# Altium project LASER_DRIVER_LN_HP.PrjPcb (part 2 of 4)

## Sheet DAC.SchDoc: AI ARTIQ Driver
size 420 x 297 mm; Author: G.Kasprowicz; CompanyName: CTI; Organization: CTI; Address1: CTI; Address2: Nowowiejska 15/19 00-665 Warsaw; Address3: gkasprow@gmail.com; DocumentNumber: 3; Revision: 1.0; SheetNumber: 3; SheetTotal: 11; ModifiedBy: -; CheckedDate: -; Title2: DAC; DivGrp: CTI; ModifiedDate: -; ProjectName: Sensor Box
Used 2 times, as channels U_DAC_LN, U_DAC_HP. Parts and nets are listed once, with the designators drawn on the sheet.
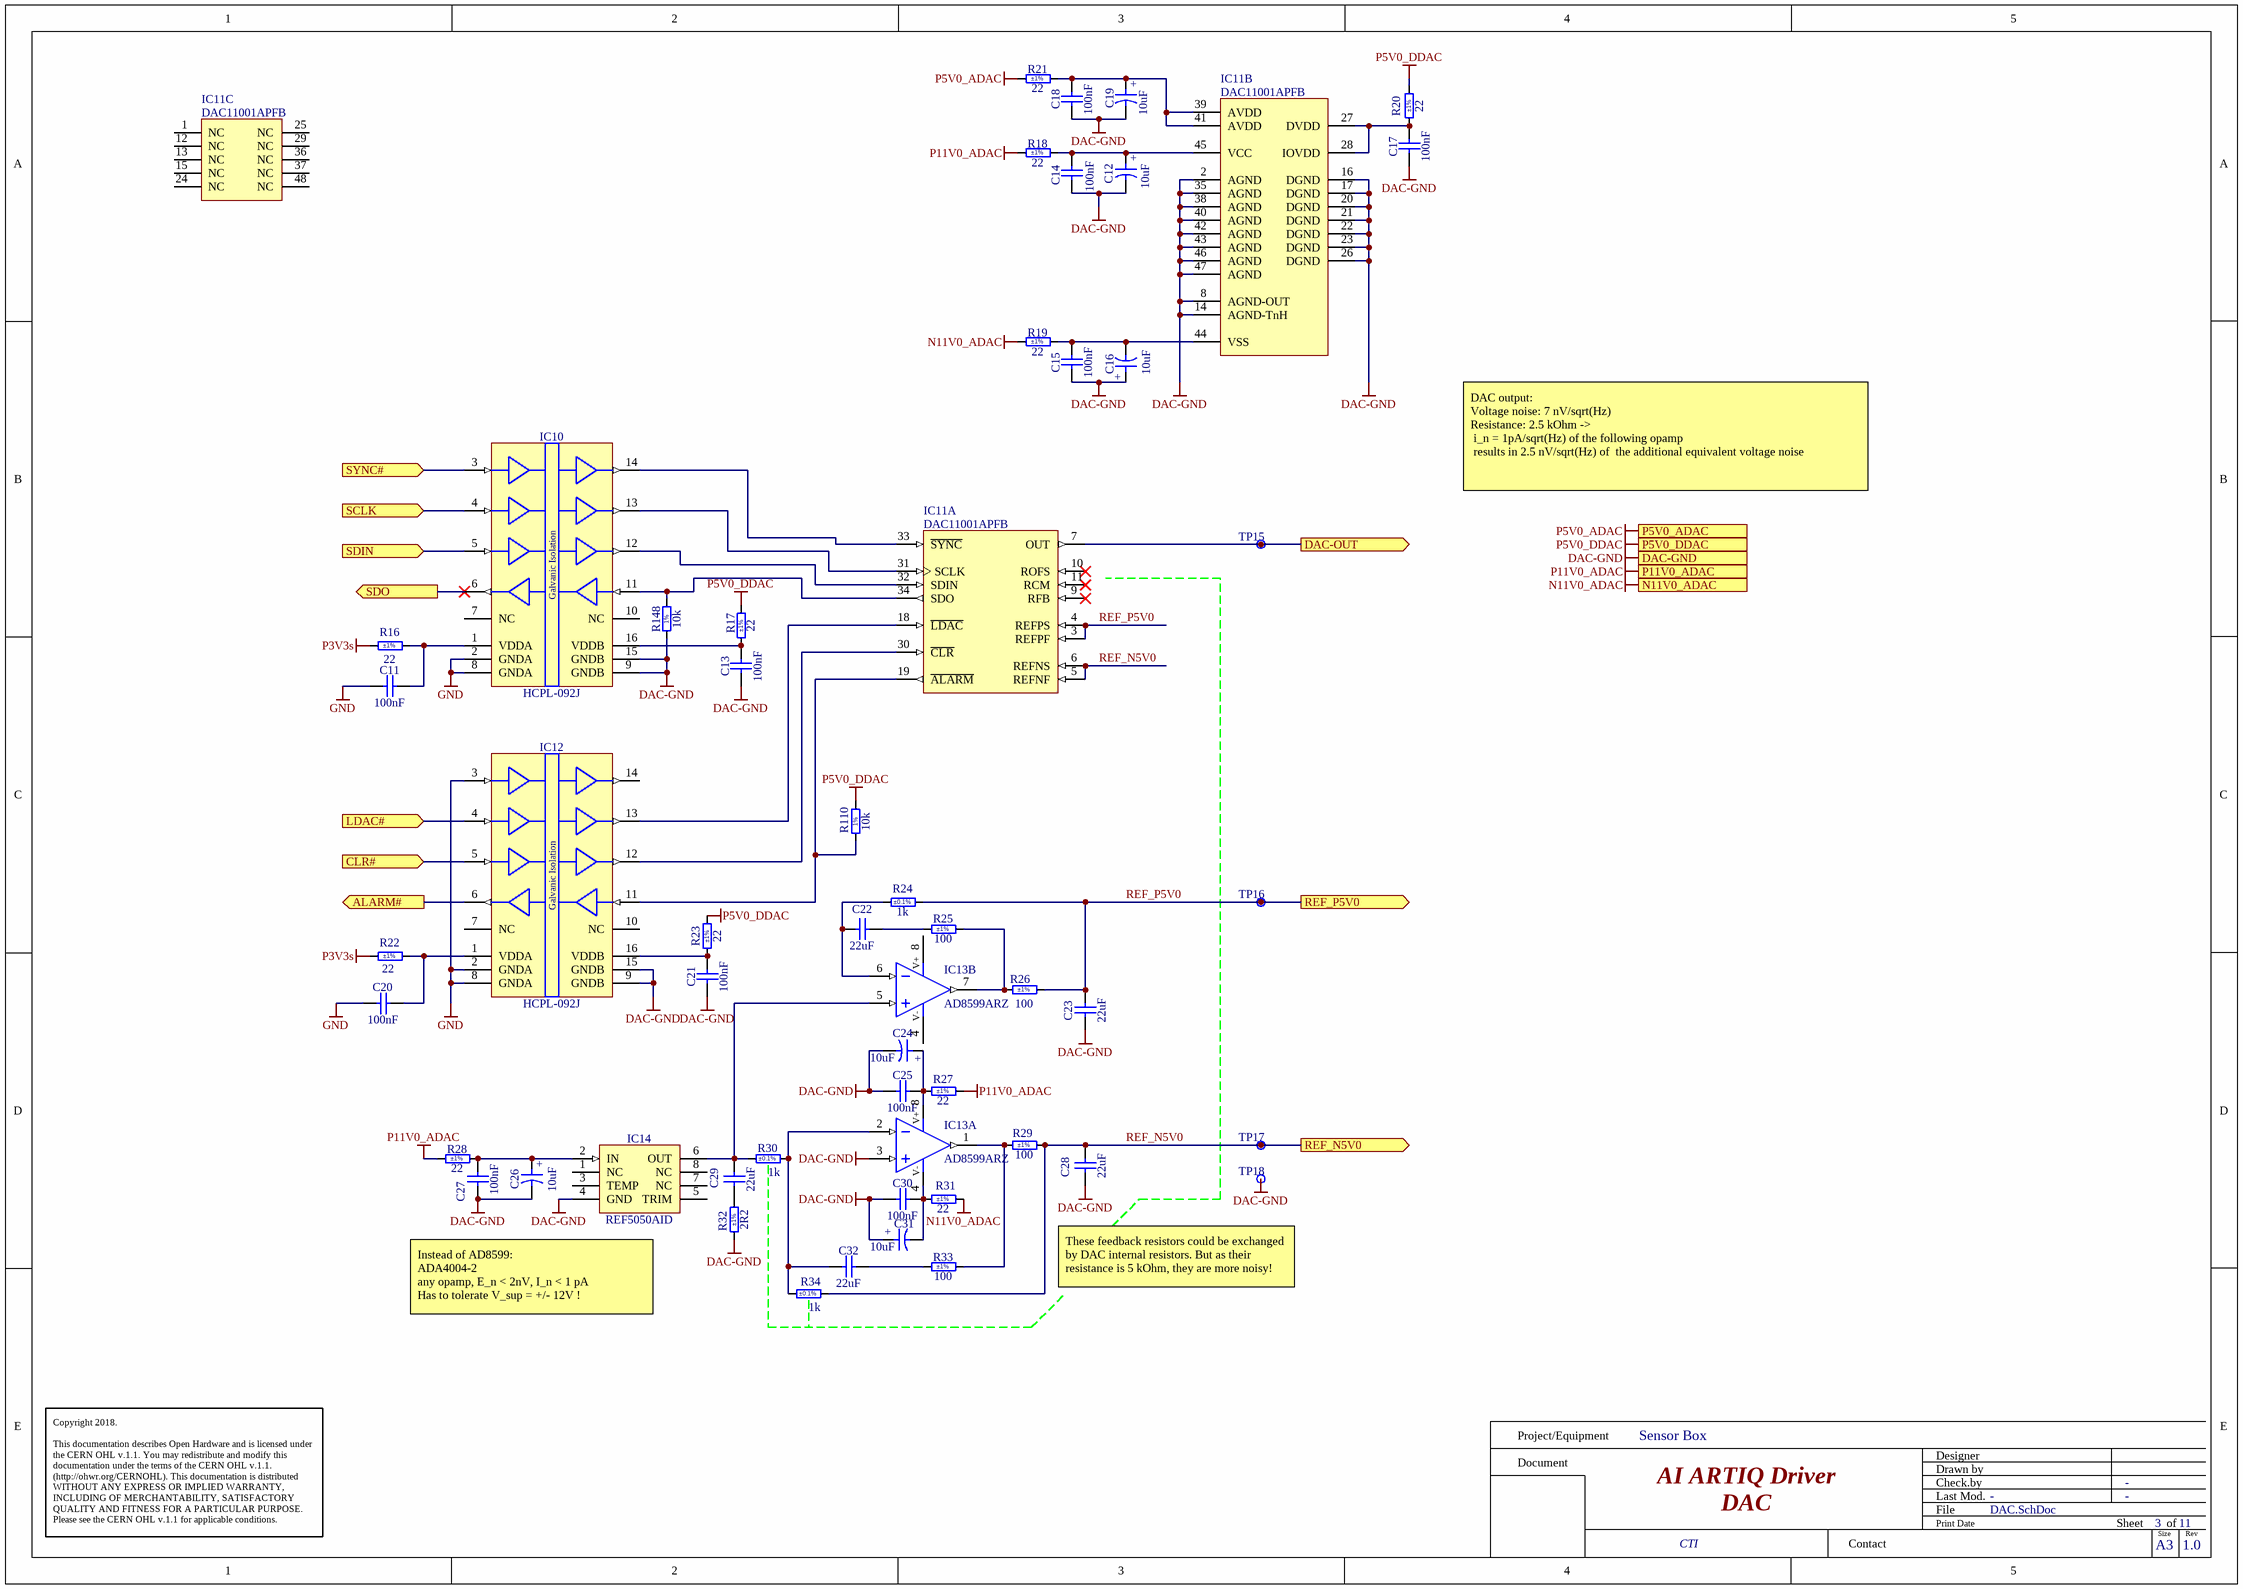
[diagram p2: DAC.SchDoc]

### Parts
C11  100nF  [CAPC1608X87N]
C12  10uF  [CAPMP3528X210N]
C13  100nF  [CAPC1608X87N]
C14  100nF  [CAPC1005X55N]
C15  100nF  [CAPC1005X55N]
C16  10uF  [CAPMP3528X210N]
C17  100nF  [CAPC1005X55N]
C18  100nF  [CAPC1005X55N]
C19  10uF  [CAPMP3528X210N]
C20  100nF  [CAPC1608X87N]
C21  100nF  [CAPC1608X87N]
C22  22uF  [CAPC2012X135N]
C23  22uF  [CAPC2012X135N]
C24  10uF  [CAPMP3528X210N]
C25  100nF  [CAPC1608X87N]
C26  10uF  [CAPMP3528X210N]
C27  100nF  [CAPC1608X87N]
C28  22uF  [CAPC2012X135N]
C29  22uF  [CAPC2012X135N]
C30  100nF  [CAPC1608X87N]
C31  10uF  [CAPMP3528X210N]
C32  22uF  [CAPC2012X135N]
IC10  HCPL-092J  [HCPL-092J]
IC11  DAC11001APFB  [QFP50P900X900X120-48N]  (parts A,B,C of 3)
IC12  HCPL-092J  [HCPL-092J]
IC13  AD8599ARZ  [SOIC127P600X175-8N]  (parts A,B of 2)
IC14  REF5050AID  [SOIC127P600X175-8N]
R16  22  Tolerance: ±1%  [RESC1608X55N]
R17  22  Tolerance: ±1%  [RESC1608X55N]
R18  22  Tolerance: ±1%  [RESC1608X55N]
R19  22  Tolerance: ±1%  [RESC1608X55N]
R20  22  Tolerance: ±1%  [RESC1608X55N]
R21  22  Tolerance: ±1%  [RESC1608X55N]
R22  22  Tolerance: ±1%  [RESC1608X55N]
R23  22  Tolerance: ±1%  [RESC1608X55N]
R24  1k  Tolerance: ±0.1%  [RESC1608X64N]
R25  100  Tolerance: ±1%  [RESC1608X55N]
R26  100  Tolerance: ±1%  [RESC1608X55N]
R27  22  Tolerance: ±1%  [RESC1608X55N]
R28  22  Tolerance: ±1%  [RESC1608X55N]
R29  100  Tolerance: ±1%  [RESC1608X55N]
R30  1k  Tolerance: ±0.1%  [RESC1608X64N]
R31  22  Tolerance: ±1%  [RESC1608X55N]
R32  2R2  Tolerance: ±1%  [RESC1608X55N]
R33  100  Tolerance: ±1%  [RESC1608X55N]
R34  1k  Tolerance: ±0.1%  [RESC1608X64N]
R110  10k  [RESC1608X55N]
R148  10k  [RESC1608X55N]
TP15  Test Point  [TPS127]  (value not drawn)  (no BOM)
TP16  Test Point  [TPS127]  (value not drawn)  (no BOM)
TP17  Test Point  [TPS127]  (value not drawn)  (no BOM)
TP18  Test Point  [TPS127]  (value not drawn)  (no BOM)

### Ports
ALARM# (out), CLR# (in), DAC-GND, DAC-OUT (out), LDAC# (in), N11V0_ADAC, P5V0_ADAC, P5V0_DDAC, P11V0_ADAC, REF_N5V0 (out), REF_P5V0 (out), SCLK (in), SDIN (in), SDO (out), SYNC# (in)

### Nets
DAC-GND: C12.2 C13.1 C14.2 C15.1 C16.1 C17.1 C18.1 C19.2 C21.1 C23.1 C24.2 C25.1 C26.2 C27.1 C28.1 C30.1 C31.1 IC10.9(GNDB) IC10.15(GNDB) IC11.2(AGND) IC11.8(AGND-OUT) IC11.14(AGND-TnH) IC11.16(DGND) IC11.17(DGND) IC11.20(DGND) IC11.21(DGND) IC11.22(DGND) IC11.23(DGND) IC11.26(DGND) IC11.35(AGND) IC11.38(AGND) IC11.40(AGND) IC11.42(AGND) IC11.43(AGND) IC11.46(AGND) IC11.47(AGND) IC12.9(GNDB) IC12.15(GNDB) IC13.3(IN+) IC14.4(GND) R32.1 R148.1 TP18.1 ; port DAC-GND
GND: C11.1 C20.1 IC10.2(GNDA) IC10.8(GNDA) IC12.2(GNDA) IC12.3(IN1) IC12.8(GNDA)
N11V0_ADAC: R19.1 R31.2 ; port N11V0_ADAC
P3V3s: R16.2 R22.2
P5V0_ADAC: R21.1 ; port P5V0_ADAC
P5V0_DDAC: R17.2 R20.2 R23.2 R110.2 ; port P5V0_DDAC
P11V0_ADAC: R18.1 R27.2 R28.1 ; port P11V0_ADAC
ALARM#: IC12.6(IN4) ; port ALARM#
CLR#: IC12.5(IN3) ; port CLR#
DAC-OUT: IC11.7(OUT) TP15.1 ; port DAC-OUT
LDAC#: IC12.4(IN2) ; port LDAC#
REF_N5V0: C28.2 IC11.5(REFNF) IC11.6(REFNS) R29.2 R34.2 TP17.1 ; port REF_N5V0
REF_P5V0: C23.2 IC11.3(REFPF) IC11.4(REFPS) R24.2 R26.2 TP16.1 ; port REF_P5V0
SCLK: IC10.4(IN2) ; port SCLK
SDIN: IC10.5(IN3) ; port SDIN
SDO: IC10.6(IN4) ; port SDO
SYNC#: IC10.3(IN1) ; port SYNC#
NetC11_2: C11.2 IC10.1(VDDA) R16.1
NetC12_1: C12.1 C14.1 IC11.45(VCC) R18.2
NetC13_2: C13.2 IC10.16(VDDB) R17.1
NetC15_2: C15.2 C16.2 IC11.44(VSS) R19.2
NetC17_2: C17.2 IC11.27(DVDD) IC11.28(IOVDD) R20.1
NetC18_2: C18.2 C19.1 IC11.39(AVDD) IC11.41(AVDD) R21.2
NetC20_2: C20.2 IC12.1(VDDA) R22.1
NetC21_2: C21.2 IC12.16(VDDB) R23.1
NetC22_1: C22.1 IC13.6(IN-) R24.1
NetC22_2: C22.2 R25.1
NetC24_1: C24.1 C25.2 IC13.8(V+) R27.1
NetC26_1: C26.1 C27.2 IC14.2(IN) R28.2
NetC29_1: C29.1 R32.2
NetC29_2: C29.2 IC13.5(IN+) IC14.6(OUT) R30.1
NetC30_2: C30.2 C31.2 IC13.4(V-) R31.1
NetC32_1: C32.1 IC13.2(IN-) R30.2 R34.1
NetC32_2: C32.2 R33.1
NetIC10_11: IC10.11(OUT4) IC11.34(SDO) R148.2
NetIC10_12: IC10.12(OUT3) IC11.32(SDIN)
NetIC10_13: IC10.13(OUT2) IC11.31(SCLK)
NetIC10_14: IC10.14(OUT1) IC11.33(~{SYNC})
NetIC11_18: IC11.18(~{LDAC}) IC12.13(OUT2)
NetIC11_19: IC11.19(~{ALARM}) IC12.11(OUT4) R110.1
NetIC11_30: IC11.30(~{CLR}) IC12.12(OUT3)
NetIC13_1: IC13.1(OUT) R29.1 R33.2
NetIC13_7: IC13.7(OUT) R25.2 R26.1

Not connected (* = marked no-connect by the designer): IC10 7(NC) 10(NC); IC11 1(NC) 9(RFB)* 10(ROFS)* 11(RCM)* 12(NC) 13(NC) 15(NC) 24(NC) 25(NC) 29(NC) 36(NC) 37(NC) 48(NC); IC12 7(NC) 10(NC) 14(OUT1); IC14 1(NC) 3(TEMP) 5(TRIM) 7(NC) 8(NC)

### Channels
U_DAC_LN: designators end in A; ports ALARM#=NetIC12A_6 CLR#=NetIC12A_5 DAC-GND=DAC-GND DAC-OUT=NetIC11A_7 LDAC#=NetIC12A_4 N11V0_ADAC=N11V0_ADAC P5V0_ADAC=P5V0_ADAC P5V0_DDAC=P5V0_DDAC P11V0_ADAC=P11V0_ADAC REF_N5V0=REF_N5V0 REF_P5V0=REF_P5V0 SCLK=SPI1_SCK SDIN=SPI1_MOSI SDO=SPI1_MISO SYNC#=SPI1_NSS
U_DAC_HP: designators end in B; ports ALARM#=NetIC12B_6 CLR#=NetIC12A_5 DAC-GND=DAC-GND DAC-OUT=NetIC7_3 LDAC#=NetIC12A_4 N11V0_ADAC=N11V0_ADAC P5V0_ADAC=P5V0_ADAC P5V0_DDAC=P5V0_DDAC P11V0_ADAC=P11V0_ADAC REF_N5V0=REF_N5V0 REF_P5V0=REF_P5V0 SCLK=SPI1_SCK SDIN=SPI1_MOSI SDO=SPI1_MISO SYNC#=PA0/UART4_TX

### Notes on the sheet
- DAC output:
  Voltage noise: 7 nV/sqrt(Hz)
  Resistance: 2.5 kOhm ->
  i_n = 1pA/sqrt(Hz) of the following opamp
  results in 2.5 nV/sqrt(Hz) of  the additional equivalent voltage noise
- Instead of AD8599:
  ADA4004-2
  any opamp, E_n < 2nV, I_n < 1 pA
  Has to tolerate V_sup = +/- 12V !
- These feedback resistors could be exchanged by DAC internal resistors. But as their resistance is 5 kOhm, they are more noisy!
- Project/Equipment
- Document
- Designer
- Drawn by
- Check.by
- Copyright 2018.
  This documentation describes Open Hardware and is licensed under the CERN OHL v.1.1. You may redistribute and modify this documentation under the terms of the CERN OHL v.1.1. (http://ohwr.org/CERNOHL). This documentation is distributed WITHOUT ANY EXPRESS OR IMPLIED WARRANTY, INCLUDING OF MERCHANTABILITY, SATISFACTORY QUALITY AND FITNESS FOR A PARTICULAR PURPOSE. Please see the CERN OHL v.1.1 for applicable conditions.
- Contact
- File
- Last Mod.
- Print Date
- Sheet
- Size
- A3
- of
- Rev
- (in symbol CTE3528-21_10UF_20V_10%_AVX_TPSB106K020T0500) +
- (in symbol HCPL-092J) Galvanic Isolation
- (in symbol R0603_10K_1%_0.1W_100PPM) 1%

### Library data of the parts
C11 C13 C20 C21 C25 C27 C30 = CC0603_100NF_50V_10%_X7R: Non-polarised capacitor; Part Description: SMD Multilayer Chip Ceramic Capacitor; Manufacturer: GENERIC; Manufacturer1 Part Number: 223858615649; Voltage: 50V; TC: X7R; Tolerance: ±10%; Part Number: CC0603_100NF_50V_10%_X7R; Component Kind: Standard; Component Type: Standard; Pin Count: 2; Value: 100nF; Status: Preferred; Manufacturer Part Number: CC0603_100NF_50V_10%_X7R; Case: 0603; Mounted: Yes; Socket: No; SMD: Yes; Sense: No; Manufacturer1 Example: PHYCOMP; Manufacturer1 ComponentHeight: 0.87mm; HelpURL: \\cern.ch\dfs\Applications\Altium\Datasheets\CC0603_X7R_PHYCOMP.pdf; Author: CERN DEM JLC; CreateDate: 03.12.2007; LatestRevisionDate: 03.12.2007
C12 C16 C19 C24 C26 C31 = CTE3528-21_10UF_20V_10%_AVX_TPSB106K020T0500: Polarised capacitor; Part Description: Low ESR 0R5 Automotive Solid Tantalum Chip Capacitor; Manufacturer: AVX; Voltage: 20V; Tolerance: ±10%; Part Number: CTE3528-21_10UF_20V_10%_AVX_TPSB106K020T0500; Component Kind: Standard; Component Type: Standard; Pin Count: 2; Value: 10uF; Status: Not Recommended; Manufacturer Part Number: TPSB106K020T0500; Case: B; Mounted: Yes; Socket: No; SMD: Yes; Sense: No; ComponentHeight: 2.1mm; HelpURL: \\cern.ch\dfs\Applications\Altium\Datasheets\CTE-LESR_AVX_TPS-AUTO.pdf; Author: CERN DEM JLC; CreateDate: 10.05.2017; LatestRevisionDate: 10.05.2017
C14 C15 C17 C18 = CC0402_100NF_50V_10%_X7R: Non-polarised capacitor; Part Description: SMD Multilayer Chip Ceramic Capacitor; Manufacturer: GENERIC; Manufacturer1 Part Number: GRM155R71H104KE14D; Voltage: 50V; TC: X7R; Tolerance: ±10%; Part Number: CC0402_100NF_50V_10%_X7R; Component Kind: Standard; Component Type: Standard; Pin Count: 2; Value: 100nF; Status: None; Manufacturer Part Number: CC0402_100NF_50V_10%_X7R; Case: 0402; Mounted: Yes; Socket: No; SMD: Yes; Sense: No; Manufacturer1 Example: MURATA; Manufacturer1 ComponentHeight: 0.55mm; HelpURL: \\cern.ch\dfs\Applications\Altium\Datasheets\CC0402_MURATA_GRM155R71H104KE14D.pdf; Author: CERN DEM MR; CreateDate: 30.06.2017; LatestRevisionDate: 30.06.2017
C22 C23 C28 C29 C32 = CC0805_22UF_16V_10%_X5R: Non-polarised capacitor; Part Description: SMD Multilayer Chip Ceramic Capacitor; Manufacturer: GENERIC; Manufacturer1 Part Number: C2012X5R1C226KT; Voltage: 16V; TC: X5R; Tolerance: ±10%; Part Number: CC0805_22UF_16V_10%_X5R; Component Kind: Standard; Component Type: Standard; Pin Count: 2; Value: 22uF; Status: Preferred; Manufacturer Part Number: CC0805_22UF_16V_10%_X5R; Case: 0805; Mounted: Yes; Socket: No; SMD: Yes; Sense: No; Manufacturer1 Example: TDK; Manufacturer1 ComponentHeight: 1.35mm; HelpURL: \\cern.ch\dfs\Applications\Altium\Datasheets\CC0805_X5R_TDK_C.pdf; Author: CERN DEM JLC; CreateDate: 25.10.2012; LatestRevisionDate: 25.10.2012
IC10 IC12 = HCPL-092J: High Speed Digital Isolators Quad, 1/3, Bidirectional; Part Description: 1/3 Channel, Bidirectional, High Speed Digital Isolators Quad; Manufacturer: BROADCOM; PressFit: No; Bonding: No; Part Number: HCPL-092J; Component Kind: Standard; Component Type: Standard; Device: HCPL-092J; Footprint: BROADCOM_HCPL-09X; PackageDescription: SOIC, 1.27mm Pitch; 16 Pin, 9.9mm W X 4.90mm L X 1.8mm H body; Manufacturer Part Number: HCPL-092J; Pin Count: 16; Case: SOIC16; Mounted: Yes; Socket: No; SMD: Yes; Sense: No; ComponentHeight: 1.8mm; Author: CERN DEM HF; HelpURL: \\cern.ch\dfs\Applications\Altium\Datasheets\HCPL-092J.pdf; CreateDate: 23.03.2022; LatestRevisionDate: 23.03.2022
IC11 = DAC11001APFB: 20 Bit, Low-Noise, Ultra-Low Harmonic Distortion, FastSettling, High-Voltage Output, Digital-to-Analog Converter; Manufacturer: TEXAS INSTRUMENTS; PressFit: No; Bonding: No; Part Number: DAC11001APFB; Component Kind: Standard; Component Type: Standard; Device: DAC11001APFB; PackageDescription: QFP, 0.50mm Pitch, Square, 48 Pin, 7.00mm L X 7.00mm W X 1.20mm H body, IPC Medium Density; Part Description: 20 Bit, Low-Noise, Ultra-Low Harmonic Distortion, FastSettling, High-Voltage Output, Digital-to-Analog Converter; Manufacturer Part Number: DAC11001APFB; Pin Count: 48; Case: QFP48; Mounted: Yes; Socket: No; SMD: Yes; Sense: No; ComponentHeight: 1.2mm; Author: CERN DEM HF; HelpURL: \\cern.ch\dfs\Applications\Altium\Datasheets\DAC11001APFB.pdf; CreateDate: 17.05.2022; LatestRevisionDate: 17.05.2022
IC13 = AD8599ARZ: Dual Operational Amplifier; Part Description: Dual, Ultralow Distorsion, Ultralow Noise Operational Amplifier; Manufacturer: ANALOG DEVICES; PressFit: No; Bonding: No; Part Number: AD8599ARZ; Component Kind: Standard; Component Type: Standard; Device: AD8599ARZ; PackageDescription: SOIC, 1.27mm Pitch; 8 Pin, 4.00mm W X 5.00mm L X 1.75mm H body, IPC Medium Density; Manufacturer Part Number: AD8599AR; Pin Count: 8; Case: SOIC8; Mounted: Yes; Socket: No; SMD: Yes; Sense: No; ComponentHeight: 1.75mm; Author: CERN DEM BC; HelpURL: \\cern.ch\dfs\Applications\Altium\Datasheets\AD8599ARZ.pdf; CreateDate: 01.12.2020; LatestRevisionDate: 29.03.2022
IC14 = REF5050AID: Low-Noise, Very Low Drift, Precision Voltage Reference; Part Description: 5V, Low-Noise, Very Low Drift, Precision Voltage Reference; Manufacturer: TEXAS INSTRUMENTS; PressFit: No; Bonding: No; Part Number: REF5050AID; Component Kind: Standard; Component Type: Standard; Device: REF5050AID; PackageDescription: SOIC 8, Pitch 1.27mm, Body 4x5mm, IPC Medium Density; Manufacturer Part Number: REF5050AID; Pin Count: 8; Case: SOIC8; Mounted: Yes; Socket: No; SMD: Yes; Sense: No; ComponentHeight: 1.75mm; HelpURL: \\cern.ch\dfs\Applications\Altium\Datasheets\REF5045AID.pdf; Author: CERN DEM HF; CreateDate: 18.05.2022; LatestRevisionDate: 18.05.2022
R16-R23 R27 R28 R31 = R0603_22R_1%_0.1W_100PPM: Resistor - 1%; Part Description: General Purpose Thick Film Chip Resistor; Manufacturer: GENERIC; Manufacturer1 Part Number: NRC06F22R0TRF; Power: 0.1W; TC: ±100ppm/°C; PressFit: No; Part Number: R0603_22R_1%_0.1W_100PPM; Component Kind: Standard; Component Type: Standard; Pin Count: 2; Value: 22; Status: Preferred; Manufacturer Part Number: R0603_22R_1%_0.1W_100PPM; Case: 0603; Mounted: Yes; Sense: No; Socket: No; SMD: Yes; Manufacturer1 Example: NIC COMPONENT; Manufacturer1 ComponentHeight: 0.55mm; HelpURL: \\cern.ch\dfs\Applications\Altium\Datasheets\R0603_NIC_NRC.pdf; Author: CERN DEM JLC; CreateDate: 03.12.2007; LatestRevisionDate: 13.03.2008
R24 R30 R34 = R0603_1K_0.1%_0.1W_25PPM: Resistor - 0.1%; Part Description: Thin Film Chip Resistor; Manufacturer: GENERIC; Manufacturer1 Part Number: ERA3AEB102V; Power: 0.1W; TC: ±25ppm/°C; PressFit: No; Part Number: R0603_1K_0.1%_0.1W_25PPM; Component Kind: Standard; Component Type: Standard; Pin Count: 2; Value: 1k; Status: Not Recommended; Manufacturer Part Number: R0603_1K_0.1%_0.1W_25PPM; Case: 0603; Mounted: Yes; Sense: No; Socket: No; SMD: Yes; Manufacturer1 Example: PANASONIC; Manufacturer1 ComponentHeight: 0.55mm; HelpURL: \\cern.ch\dfs\Applications\Altium\Datasheets\R0603_PANASONIC_ERA.pdf; Author: CERN DEM JLC; CreateDate: 11.01.2017; LatestRevisionDate: 11.01.2017
R25 R26 R29 R33 = R0603_100R_1%_0.1W_100PPM: Resistor - 1%; Part Description: General Purpose Thick Film Chip Resistor; Manufacturer: GENERIC; Manufacturer1 Part Number: NRC06F4700TRF; Power: 0.1W; TC: ±100ppm/°C; PressFit: No; Part Number: R0603_100R_1%_0.1W_100PPM; Component Kind: Standard; Component Type: Standard; Pin Count: 2; Value: 100; Status: Preferred; Manufacturer Part Number: R0603_100R_1%_0.1W_100PPM; Case: 0603; Mounted: Yes; Sense: No; Socket: No; SMD: Yes; Manufacturer1 Example: NIC COMPONENT; Manufacturer1 ComponentHeight: 0.55mm; HelpURL: \\cern.ch\dfs\Applications\Altium\Datasheets\R0603_NIC_NRC.pdf; Author: CERN DEM JLC; CreateDate: 03.12.2007; LatestRevisionDate: 13.03.2008
R32 = R0603_2R2_1%_0.1W_200PPM: Resistor - 1%; Part Description: General Purpose Thick Film Chip Resistor; Manufacturer: GENERIC; Manufacturer1 Part Number: 232270462208L or RC0603FR-072R2L; Power: 0.1W; TC: ±200ppm/°C; PressFit: No; Part Number: R0603_2R2_1%_0.1W_200PPM; Component Kind: Standard; Component Type: Standard; Pin Count: 2; Value: 2R2; Status: Preferred; Manufacturer Part Number: R0603_2R2_1%_0.1W_200PPM; Case: 0603; Mounted: Yes; Sense: No; Socket: No; SMD: Yes; Manufacturer1 Example: YAGEO PHYCOMP; Manufacturer1 ComponentHeight: 0.65mm; HelpURL: \\cern.ch\dfs\Applications\Altium\Datasheets\R0603_Tyco_RN73.pdf; Author: CERN DEM JLC; CreateDate: 03.12.2007; LatestRevisionDate: 17.10.2012
R110 R148 = R0603_10K_1%_0.1W_100PPM: Resistor - 1%; Part Description: General Purpose Thick Film Chip Resistor; Manufacturer: GENERIC; Manufacturer1 Part Number: NRC06F1002TRF; Power: 0.1W; TC: ±100ppm/°C; PressFit: No; Part Number: R0603_10K_1%_0.1W_100PPM; Component Kind: Standard; Component Type: Standard; Pin Count: 2; Value: 10k; Status: Preferred; Tolerance: ±1%; Manufacturer Part Number: R0603_10K_1%_0.1W_100PPM; Case: 0603; Mounted: Yes; Sense: No; Socket: No; SMD: Yes; Manufacturer1 Example: NIC COMPONENT; Manufacturer1 ComponentHeight: 0.55mm; HelpURL: \\cern.ch\dfs\Applications\Altium\Datasheets\R0603_NIC_NRC.pdf; Author: CERN DEM JLC; CreateDate: 03.12.2007; LatestRevisionDate: 13.03.2008
TP15-TP18 = SMD_PAD_1.27X1.27MM: Part Description: 1.27mm x 1.27mm PCB Copper Area (SMD Test Point); Mounted: No; Part Number: SMD_PAD_1.27X1.27MM; Component Type: Standard (No BOM); Pin Count: 1; Family: Test Point; Socket: No; SMD: No; Sense: No; Status: None; ComponentHeight: 0mm; HelpURL: Undefined; Author: CERN DEM JLC; CreateDate: 12.01.2008; LatestRevisionDate: 12.01.2008; PackageDescription: 1.27mm x 1.27mm PCB Copper Area (SMD Test Point)

## Sheet connectors.SchDoc: AI ARTIQ Driver
size 420 x 297 mm; Author: G.Kasprowicz; CompanyName: CTI; Organization: CTI; Address1: CTI; Address2: Nowowiejska 15/19 00-665 Warsaw; Address3: gkasprow@gmail.com; DocumentNumber: 4; Revision: 1.0; SheetNumber: 4; SheetTotal: 11; ModifiedBy: -; CheckedDate: -; Title2: connectors; DivGrp: CTI; ModifiedDate: -; ProjectName: Sensor Box
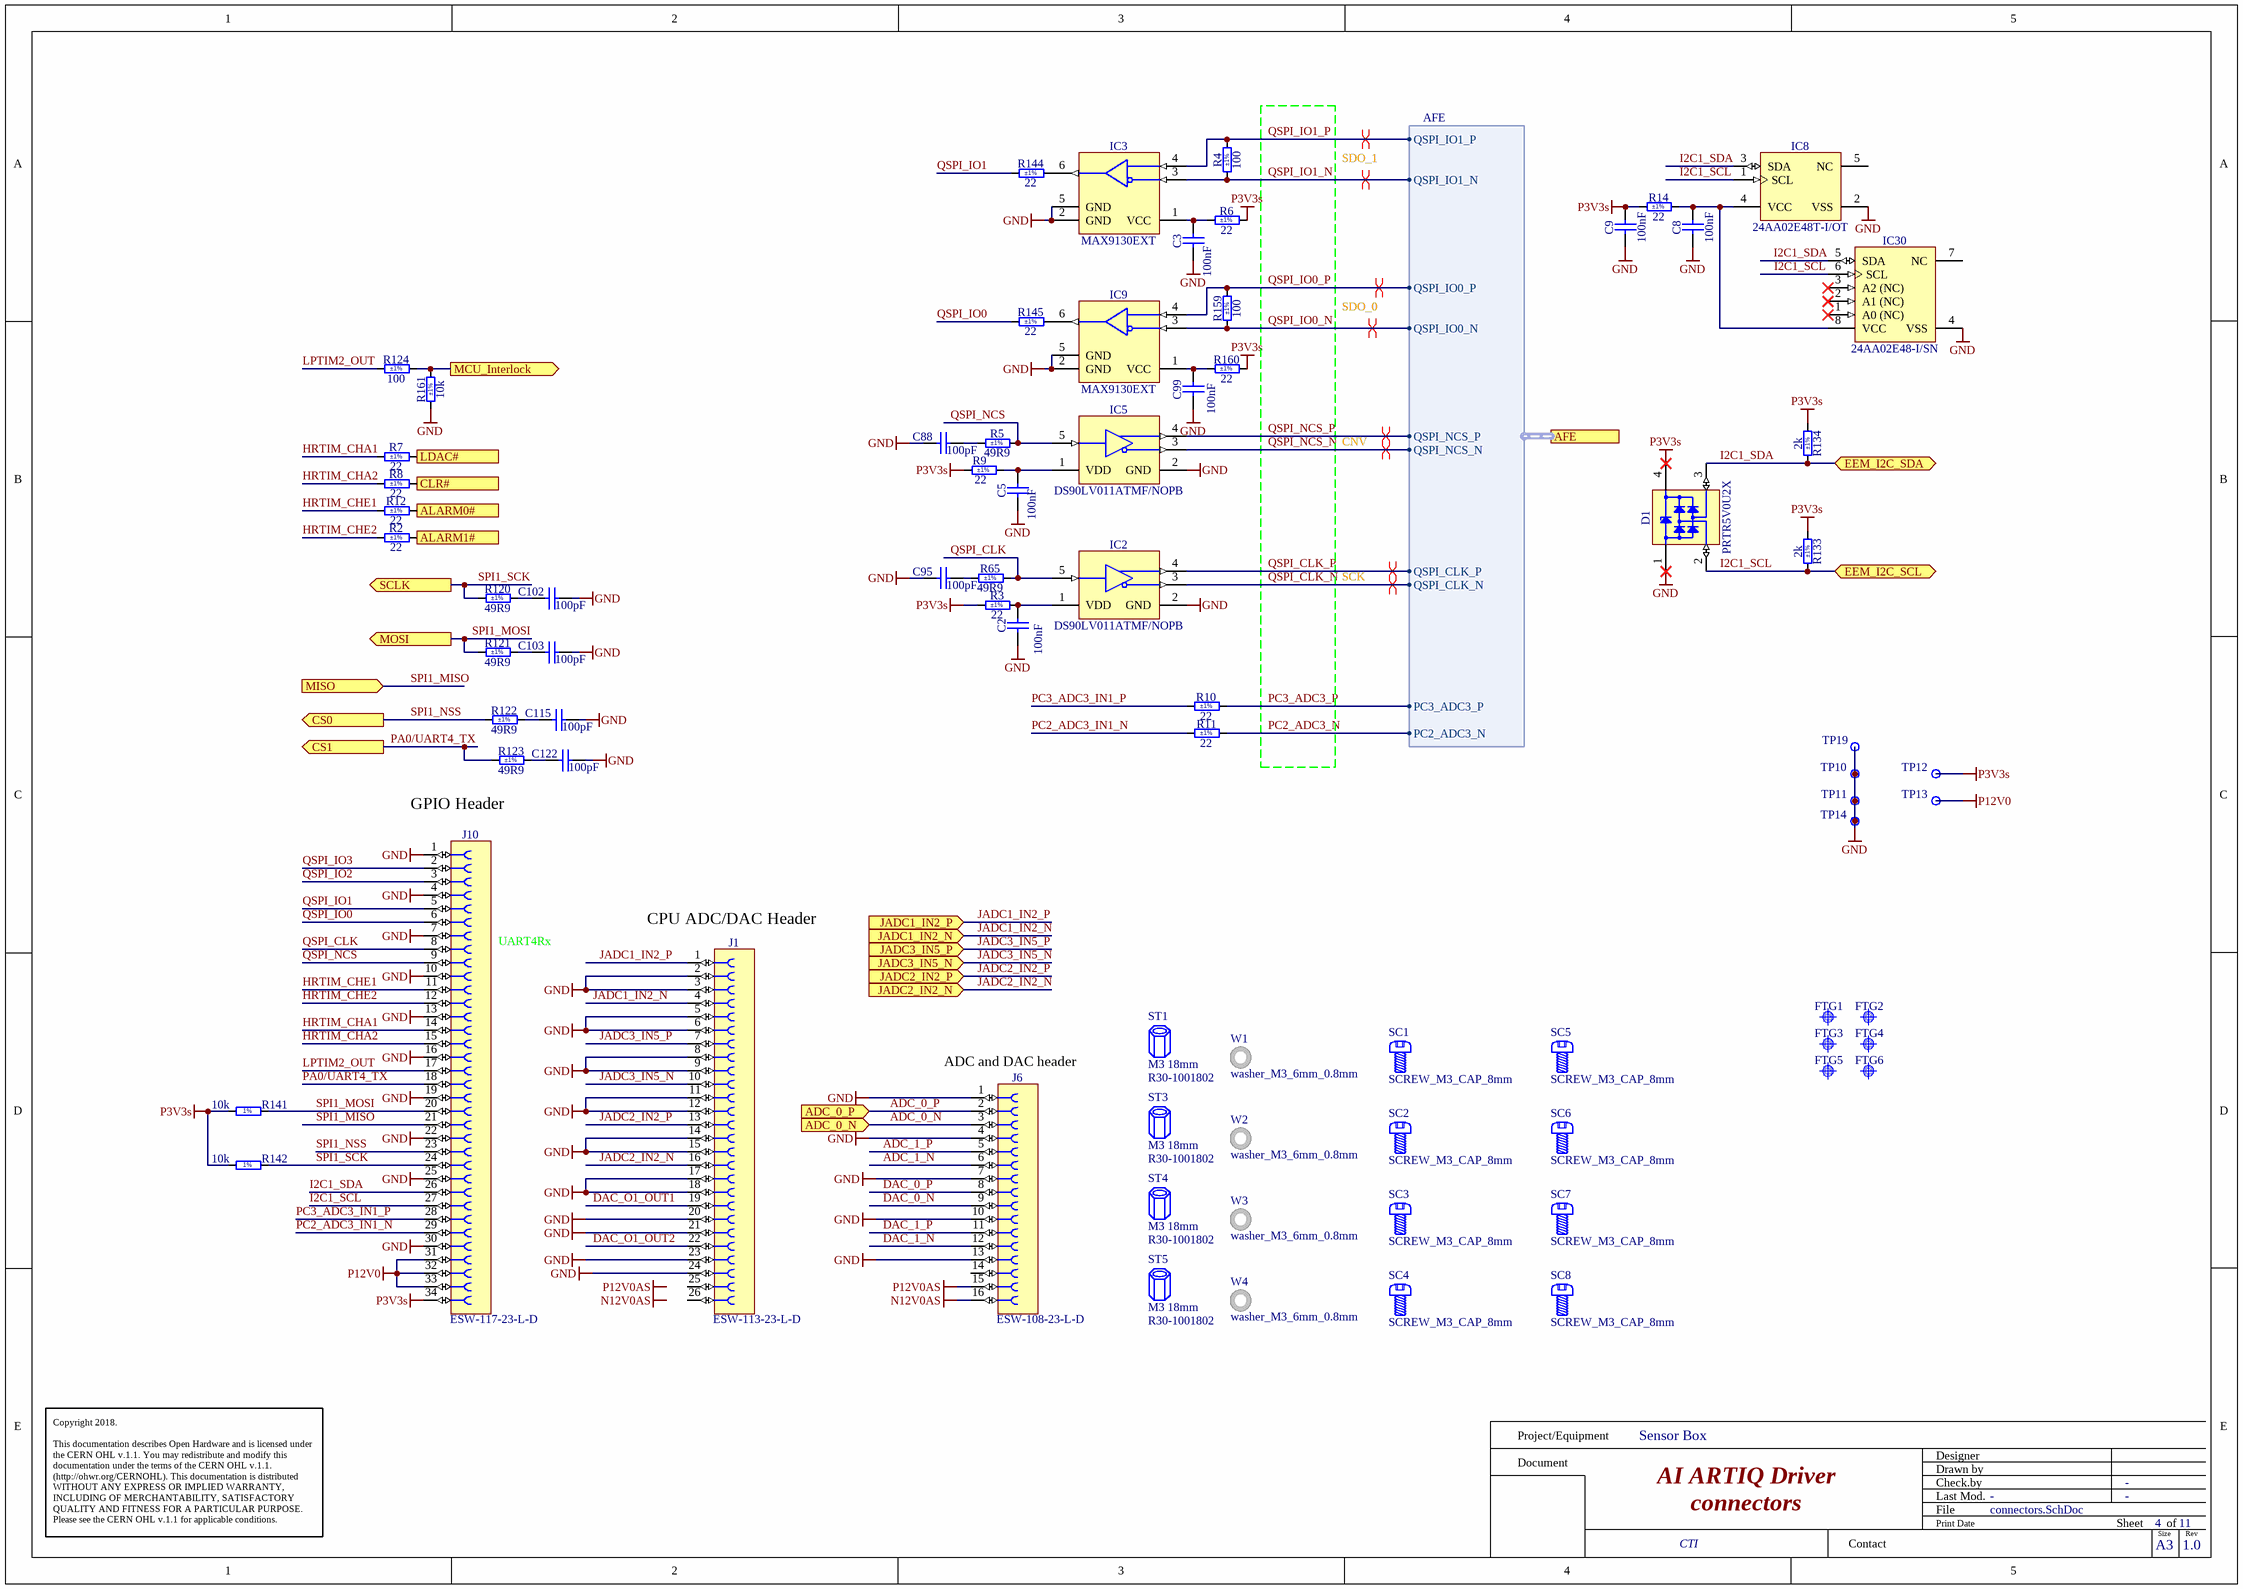
[diagram p3: connectors.SchDoc]

### Parts
C2  100nF  [CAPC2012X135N]
C3  100nF  [CAPC2012X135N]
C5  100nF  [CAPC2012X135N]
C8  100nF  [CAPC2012X135N]
C9  100nF  [CAPC2012X135N]
C88  100pF  [CAPC1005X55N]
C95  100pF  [CAPC1005X55N]
C99  100nF  [CAPC2012X135N]
C102  100pF  [CAPC1005X55N]
C103  100pF  [CAPC1005X55N]
C115  100pF  [CAPC1005X55N]
C122  100pF  [CAPC1005X55N]
D1  PRTR5V0U2X  [SOT190P230X110-4N]
FTG1  Use only in PCB  [FIDUCIAL_TOP_C100-200]  (value not drawn)  (no BOM)
FTG2  Use only in PCB  [FIDUCIAL_TOP_C100-200]  (value not drawn)  (no BOM)
FTG3  Use only in PCB  [FIDUCIAL_TOP_C100-200]  (value not drawn)  (no BOM)
FTG4  Use only in PCB  [FIDUCIAL_TOP_C100-200]  (value not drawn)  (no BOM)
FTG5  Use only in PCB  [FIDUCIAL_TOP_C100-200]  (value not drawn)  (no BOM)
FTG6  Use only in PCB  [FIDUCIAL_TOP_C100-200]  (value not drawn)  (no BOM)
IC2  DS90LV011ATMF/NOPB  [SOT95P284X122-5N]
IC3  MAX9130EXT  [SOT65P210X110-6N]
IC5  DS90LV011ATMF/NOPB  [SOT95P284X122-5N]
IC8  24AA02E48T-I/OT  [SOT95P280X145-5N]
IC9  MAX9130EXT  [SOT65P210X110-6N]
IC30  24AA02E48-I/SN  [SOIC127P600X175-8N]
J1  ESW-113-23-L-D  [ESW-113-23-L-D]
J6  ESW-108-23-L-D  [ESW-108-23-L-D]
J10  ESW-117-23-L-D  [ESW-117-23-L-D]
R2  22  Tolerance: ±1%  [RESC1608X55N]
R3  22  Tolerance: ±1%  [RESC1608X55N]
R4  100  Tolerance: ±1%  [RESC1608X55N]
R5  49R9  Tolerance: ±1%  [RESC1005X40N]
R6  22  Tolerance: ±1%  [RESC1608X55N]
R7  22  Tolerance: ±1%  [RESC1608X55N]
R8  22  Tolerance: ±1%  [RESC1608X55N]
R9  22  Tolerance: ±1%  [RESC1608X55N]
R10  22  Tolerance: ±1%  [RESC1608X55N]
R11  22  Tolerance: ±1%  [RESC1608X55N]
R12  22  Tolerance: ±1%  [RESC1608X55N]
R14  22  Tolerance: ±1%  [RESC1608X55N]
R65  49R9  Tolerance: ±1%  [RESC1005X40N]
R120  49R9  Tolerance: ±1%  [RESC1005X40N]
R121  49R9  Tolerance: ±1%  [RESC1005X40N]
R122  49R9  Tolerance: ±1%  [RESC1005X40N]
R123  49R9  Tolerance: ±1%  [RESC1005X40N]
R124  100  Tolerance: ±1%  [RESC1005X40N]
R133  2k  Tolerance: ±1%  [RESC1608X55N]
R134  2k  Tolerance: ±1%  [RESC1608X55N]
R141  10k  [RESC1005X40N]
R142  10k  [RESC1005X40N]
R144  22  Tolerance: ±1%  [RESC1608X55N]
R145  22  Tolerance: ±1%  [RESC1608X55N]
R159  100  Tolerance: ±1%  [RESC1608X55N]
R160  22  Tolerance: ±1%  [RESC1608X55N]
R161  10k  Tolerance: ±1%  [RESC1005X40N]
SC1  SCREW_M3_CAP_8mm  [SCREW_M3_CAP_8mm]  (mechanical)
SC2  SCREW_M3_CAP_8mm  [SCREW_M3_CAP_8mm]  (mechanical)
SC3  SCREW_M3_CAP_8mm  [SCREW_M3_CAP_8mm]  (mechanical)
SC4  SCREW_M3_CAP_8mm  [SCREW_M3_CAP_8mm]  (mechanical)
SC5  SCREW_M3_CAP_8mm  [SCREW_M3_CAP_8mm]  (mechanical)
SC6  SCREW_M3_CAP_8mm  [SCREW_M3_CAP_8mm]  (mechanical)
SC7  SCREW_M3_CAP_8mm  [SCREW_M3_CAP_8mm]  (mechanical)
SC8  SCREW_M3_CAP_8mm  [SCREW_M3_CAP_8mm]  (mechanical)
ST1  M3 18mm  [R30-1001802]  (mechanical)
ST3  M3 18mm  [R30-1001802]  (mechanical)
ST4  M3 18mm  [R30-1001802]  (mechanical)
ST5  M3 18mm  [R30-1001802]  (mechanical)
TP10  Test Point  [TPS127]  (value not drawn)  (no BOM)
TP11  Test Point  [TPS127]  (value not drawn)  (no BOM)
TP12  Test Point  [TPS127]  (value not drawn)  (no BOM)
TP13  Test Point  [TPS127]  (value not drawn)  (no BOM)
TP14  Test Point  [TPS127]  (value not drawn)  (no BOM)
TP19  Test Point  [VERO_20-313145]  (value not drawn)
W1  washer_M3_6mm_0.8mm  [washer_M3_6mm_0.8mm]  (mechanical)
W2  washer_M3_6mm_0.8mm  [washer_M3_6mm_0.8mm]  (mechanical)
W3  washer_M3_6mm_0.8mm  [washer_M3_6mm_0.8mm]  (mechanical)
W4  washer_M3_6mm_0.8mm  [washer_M3_6mm_0.8mm]  (mechanical)

### Ports
ADC_0_N (in), ADC_0_P (in), AFE (harness AFE), ALARM0# (in), ALARM1# (in), CLR# (out), CS0 (out), CS1 (out), EEM_I2C_SCL (bidir), EEM_I2C_SDA (bidir), JADC1_IN2_N (in), JADC1_IN2_P (in), JADC2_IN2_N (in), JADC2_IN2_P (in), JADC3_IN5_N (in), JADC3_IN5_P (in), LDAC# (out), MCU_Interlock (out), MISO (in), MOSI (out), SCLK (out)

### Harnesses
AFE: QSPI_IO1_P, QSPI_IO1_N, QSPI_IO0_P, QSPI_IO0_N, QSPI_NCS_P, QSPI_NCS_N, QSPI_CLK_P, QSPI_CLK_N, PC3_ADC3_P, PC2_ADC3_N

### Nets
GND: C2.1 C3.1 C5.1 C8.1 C9.1 C88.1 C95.1 C99.1 C102.2 C103.2 C115.2 C122.2 D1.1(GND) IC2.2(GND) IC3.2(GND) IC3.5(GND) IC5.2(GND) IC8.2(VSS) IC9.2(GND) IC9.5(GND) IC30.4(VSS) J1.2 J1.3 J1.5 J1.6 J1.8 J1.9 J1.11 J1.12 J1.14 J1.15 J1.17 J1.18 J1.20 J1.21 J1.23 J1.24 J6.1 J6.4 J6.7 J6.10 J6.13 J10.1 J10.4 J10.7 J10.10 J10.13 J10.16 J10.19 J10.22 J10.25 J10.30 R161.1 TP10.1 TP11.1 TP14.1 TP19.1
N12V0AS: J6.16
P3V3s: C9.2 D1.4(VCC) J10.34 R3.1 R6.2 R9.2 R14.1 R133.1 R134.1 R141.1 R142.1 R160.2 TP12.1
P12V0: J10.31 J10.32 J10.33 TP13.1
P12V0AS: J6.15
ADC_0_N: J6.3 ; port ADC_0_N
ADC_0_P: J6.2 ; port ADC_0_P
ADC_1_N: J6.6
ADC_1_P: J6.5
DAC_0_N: J6.9
DAC_0_P: J6.8
DAC_1_N: J6.12
DAC_1_P: J6.11
DAC_O1_OUT1: J1.19
DAC_O1_OUT2: J1.22
HRTIM_CHA1: J10.14 R7.1
HRTIM_CHA2: J10.15 R8.1
HRTIM_CHE1: J10.11 R12.1
HRTIM_CHE2: J10.12 R2.1
I2C1_SCL: D1.2(I/O1) IC8.1(SCL) IC30.6(SCL) J10.27 R133.2 ; port EEM_I2C_SCL
I2C1_SDA: D1.3(I/O2) IC8.3(SDA) IC30.5(SDA) J10.26 R134.2 ; port EEM_I2C_SDA
JADC1_IN2_N: J1.4 ; port JADC1_IN2_N
JADC1_IN2_P: J1.1 ; port JADC1_IN2_P
JADC2_IN2_N: J1.16 ; port JADC2_IN2_N  [project net CURR_MON_LN]
JADC2_IN2_P: J1.13 ; port JADC2_IN2_P  [project net CURR_MON_HP]
JADC3_IN5_N: J1.10 ; port JADC3_IN5_N
JADC3_IN5_P: J1.7 ; port JADC3_IN5_P
LPTIM2_OUT: J10.17 R124.1
MCU_Interlock: R124.2 R161.2 ; port MCU_Interlock
PA0/UART4_TX: J10.18 R123.1 ; port CS1
PC2_ADC3_IN1_N: J10.29 R11.1
PC2_ADC3_N: R11.2 ; port AFE.PC2_ADC3_N
PC3_ADC3_IN1_P: J10.28 R10.1
PC3_ADC3_P: R10.2 ; port AFE.PC3_ADC3_P
QSPI_CLK: IC2.5(TTLIN) J10.8 R65.2
QSPI_CLK_N: IC2.3(OUT-) ; port AFE.QSPI_CLK_N
QSPI_CLK_P: IC2.4(OUT+) ; port AFE.QSPI_CLK_P
QSPI_IO0: J10.6 R145.1
QSPI_IO0_N: IC9.3(IN-) R159.1 ; port AFE.QSPI_IO0_N
QSPI_IO0_P: IC9.4(IN+) R159.2 ; port AFE.QSPI_IO0_P
QSPI_IO1: J10.5 R144.1
QSPI_IO1_N: IC3.3(IN-) R4.1 ; port AFE.QSPI_IO1_N
QSPI_IO1_P: IC3.4(IN+) R4.2 ; port AFE.QSPI_IO1_P
QSPI_IO2: J10.3
QSPI_IO3: J10.2
QSPI_NCS: IC5.5(TTLIN) J10.9 R5.2
QSPI_NCS_N: IC5.3(OUT-) ; port AFE.QSPI_NCS_N
QSPI_NCS_P: IC5.4(OUT+) ; port AFE.QSPI_NCS_P
SPI1_MISO: J10.21 ; port MISO
SPI1_MOSI: J10.20 R121.1 R141.2 ; port MOSI
SPI1_NSS: J10.23 R122.1 ; port CS0
SPI1_SCK: J10.24 R120.1 R142.2 ; port SCLK
NetC2_2: C2.2 IC2.1(VDD) R3.2
NetC3_2: C3.2 IC3.1(VCC) R6.1
NetC5_2: C5.2 IC5.1(VDD) R9.1
NetC8_2: C8.2 IC8.4(VCC) IC30.8(VCC) R14.2
NetC88_2: C88.2 R5.1
NetC95_2: C95.2 R65.1
NetC99_2: C99.2 IC9.1(VCC) R160.1
NetC102_1: C102.1 R120.2
NetC103_1: C103.1 R121.2
NetC115_1: C115.1 R122.2
NetC122_1: C122.1 R123.2
NetIC3_6: IC3.6(OUT) R144.2
NetIC9_6: IC9.6(OUT) R145.2
NetIC12A_4: R7.2 ; port LDAC#
NetIC12A_5: R8.2 ; port CLR#
NetIC12A_6: R12.2 ; port ALARM0#
NetIC12B_6: R2.2 ; port ALARM1#

Not connected (* = marked no-connect by the designer): IC8 5(NC); IC30 1(A0_(NC))* 2(A1_(NC))* 3(A2_(NC))* 7(NC); J1 25 26; J6 14

### Layout directives
differential pair: QSPI_CLK_N, QSPI_CLK_P, QSPI_IO0_N, QSPI_IO0_P, QSPI_IO1_N, QSPI_IO1_P, QSPI_NCS_N, QSPI_NCS_P

### Notes on the sheet
- SDO_1
- SDO_0
- CNV
- SCK
- GPIO Header
- (near J1) CPU ADC/DAC Header
- (near J10) UART4Rx
- (near J6) ADC and DAC header
- Labels drawn without touching a wire or pin: N12V0AS, P12V0AS
- Project/Equipment
- Document
- Designer
- Drawn by
- Check.by
- Copyright 2018.
  This documentation describes Open Hardware and is licensed under the CERN OHL v.1.1. You may redistribute and modify this documentation under the terms of the CERN OHL v.1.1. (http://ohwr.org/CERNOHL). This documentation is distributed WITHOUT ANY EXPRESS OR IMPLIED WARRANTY, INCLUDING OF MERCHANTABILITY, SATISFACTORY QUALITY AND FITNESS FOR A PARTICULAR PURPOSE. Please see the CERN OHL v.1.1 for applicable conditions.
- Contact
- File
- Last Mod.
- Print Date
- Sheet
- Size
- A3
- of
- Rev
- (in symbol R0402_10K_1%_0.0625W_100PPM) 1%

### Library data of the parts
C2 C3 C5 C8 C9 C99 = CC0805_100NF_50V_10%_X7R: Non-polarised capacitor; Part Description: SMD Multilayer Chip Ceramic Capacitor; Manufacturer: GENERIC; Manufacturer1 Part Number: C2012X7R1H104K085AA; Voltage: 50V; TC: X7R; Tolerance: ±10%; Part Number: CC0805_100NF_50V_10%_X7R; Component Kind: Standard; Component Type: Standard; Pin Count: 2; Value: 100nF; Status: Preferred; Manufacturer Part Number: CC0805_100NF_50V_10%_X7R; Case: 0805; Mounted: Yes; Socket: No; SMD: Yes; Sense: No; Manufacturer1 Example: TDK; Manufacturer1 ComponentHeight: 1mm; HelpURL: \\cern.ch\dfs\Applications\Altium\Datasheets\CC0805_X7R_TDK_C.pdf; Author: CERN DEM JLC; CreateDate: 03.12.2007; LatestRevisionDate: 22.04.2015
C88 C95 C102 C103 C115 C122 = CC0402_100PF_50V_5%_C0G: Non-polarised capacitor; Part Description: SMD Multilayer Chip Ceramic Capacitor; Manufacturer: GENERIC; Manufacturer1 Part Number: C0402C101J5GACTU; Voltage: 50V; TC: C0G/NP0; Tolerance: ±5%; Part Number: CC0402_100PF_50V_5%_C0G; Component Kind: Standard; Component Type: Standard; Pin Count: 2; Value: 100pF; Status: Preferred; Manufacturer Part Number: CC0402_100PF_50V_5%_C0G; Case: 0402; Mounted: Yes; Socket: No; SMD: Yes; Sense: No; Manufacturer1 Example: KEMET; Manufacturer1 ComponentHeight: 0.55mm; HelpURL: \\cern.ch\dfs\Applications\Altium\Datasheets\CC0402_C0G_KEMET_(Commercial Grade).pdf; Author: CERN DEM JLC; CreateDate: 03.12.2007; LatestRevisionDate: 22.04.2015
D1 = PRTR5V0U2X: Ultra Low Capacitance Double Rail-to-Rail ESD Protection Diode; Part Description: Ultra Low Capacitance (1pF) Double Rail-to-Rail ESD Protection Diode (8kV); Manufacturer: NXP SEMICONDUCTORS; Voltage: 5.5V; PressFit: No; Bonding: No; Part Number: PRTR5V0U2X; Component Kind: Standard; Component Type: Standard; Device: PRTR5V0U2X; PackageDescription: SOT143B, SOT, 1.90mm Pitch; 4 Pin, 1.30mm W X 2.90mm L X 1.10mm H body, IPC Medium Density; Manufacturer Part Number: PRTR5V0U2X; Pin Count: 4; Case: SOT143B; Mounted: Yes; Socket: No; SMD: Yes; Sense: No; ComponentHeight: 1.1mm; HelpURL: \\cern.ch\dfs\Applications\Altium\Datasheets\PRTR5V0U2X.pdf; Author: CERN DEM JLC; CreateDate: 22.03.2011; LatestRevisionDate: 22.03.2011
FTG1-FTG6 = FIDUCIAL_TARGET_C100-200: Fiducial Target; Part Description: Round Fiducial Target, Top Layer, 1.0mm, Top Solder 2.0mm, Keepout =2.0mm; Mounted: No; Part Number: FIDUCIAL_TARGET_C100-200; Component Type: Standard (No BOM); Pin Count: 1; Family: Fiducial; Socket: No; SMD: Yes; Sense: No; Status: None; ComponentHeight: 0mm; HelpURL: Undefined; Author: CERN DEM JLC; CreateDate: 09/02/2010; LatestRevisionDate: 04/04/2012; PackageDescription: Round Fiducial Target, Top Layer, 1.0mm, Top Solder 2.0mm, Keepout =2.0mm
IC2 IC5 = DS90LV011ATMF/NOPB: 3V LVDS Single High Speed Differential Driver; Manufacturer: NATIONAL SEMICONDUCTOR; PressFit: No; Bonding: No; Part Number: DS90LV011ATMF/NOPB; Component Kind: Standard; Component Type: Standard; Device: DS90LV011ATMF/NOPB; PackageDescription: SOT, 0.95mm Pitch; 5 Pin, 1.67mm W X 2.99mm L X 1.22mm H body, IPC Medium Density; Part Description: 3V LVDS Single High Speed Differential Driver; Manufacturer Part Number: DS90LV011ATMF; Pin Count: 5; Case: SOT23-5; Mounted: Yes; Socket: No; SMD: Yes; Sense: No; ComponentHeight: 1.19mm; Author: CERN DEM JLC; HelpURL: \\cern.ch\dfs\Applications\Altium\Datasheets\DS90LV011ATMF-NOPB.pdf; CreateDate: 25.04.2012; LatestRevisionDate: 01.06.2022
IC3 IC9 = MAX9130EXT: Single 500Mbps LVDS Line Receiver; Manufacturer: MAXIM; PressFit: No; Bonding: No; Part Number: MAX9130EXT; Component Kind: Standard; Component Type: Standard; Device: MAX9130EXT; PackageDescription: SOT363, SC70-6, SOT, 0.65mm Pitch, 6 Pin, 1.25mm W X 2.00mm L X 1.10mm H, IPC Medium Density; Part Description: Single 500Mbps LVDS Line Receiver; Manufacturer Part Number: MAX9130EXT; Pin Count: 6; Case: SOT363; Mounted: Yes; Socket: No; SMD: Yes; Sense: No; ComponentHeight: 1.1mm; Author: CERN DEM HF; HelpURL: \\cern.ch\dfs\Applications\Altium\Datasheets\MAX9130EXT.pdf; CreateDate: 18.05.2022; LatestRevisionDate: 18.05.2022
IC8 = 24AA02E48T-I/OT: 1.7V-5.5V, 2K I2C Serial EEPROM With EUI-48 Node Identity; Manufacturer: MICROCHIP TECHNOLOGY; PressFit: No; Bonding: No; Part Number: 24AA02E48T-I/OT; Component Kind: Standard; Component Type: Standard; Device: 24AA02E48T-I/OT; PackageDescription: SOT, 0.95mm pitch; 5 pin, 1.60mm W X 2.90mm L X 1.45mm H body, IPC Medium Density; Part Description: 1.7V-5.5V, 2K I2C Serial EEPROM With EUI-48 Node Identity; Manufacturer Part Number: 24AA02E48T-I/OT; Pin Count: 5; Case: SOT23-5; Mounted: Yes; Socket: No; SMD: Yes; Sense: No; ComponentHeight: 1.45mm; HelpURL: \\cern.ch\dfs\Applications\Altium\Datasheets\24AA02E48T-I-OT.pdf; Author: CERN DEM MR; CreateDate: 31.03.2016; LatestRevisionDate: 31.03.2016
IC30 = MEM_24AA02E48-I/SN: 1.7V-5.5V, 2K I2C™ Serial EEPROMs with EUI-48™ Node Identity; Manufacturer: MICROCHIP TECHNOLOGY; PressFit: No; Bonding: No; Part Number: 24AA02E48-I/SN; Component Kind: Standard; Component Type: Standard; Device: 24AA02E48-I/SN; PackageDescription: SOIC, 1.27mm Pitch; 8 Pin - Body 4x5mm, IPC Medium Density; Part Description: 1.7V-5.5V, 2K I2C™ Serial EEPROMs with EUI-48™ Node Identity; Manufacturer Part Number: 24AA02E48-I/SN; Pin Count: 8; Case: SOIC8; Mounted: Yes; Socket: No; SMD: Yes; Sense: No; ComponentHeight: 1.75mm; HelpURL: \\cern.ch\dfs\Applications\Altium\Datasheets\24AA025E48-I-SN.pdf; Author: CERN DEM MR; CreateDate: 19.07.2016; LatestRevisionDate: 19.07.2016
J1 = ESW-113-23-L-D: Connector Elevated Socket 26 POS 2.54mm, 13.59mm height; Manufacturer: Samtec; Manufacturer Part Number: ESW-113-23-L-D
J6 = ESW-108-23-L-D: Connector Elevated Socket 16 POS 2.54mm, 13.59mm height; Manufacturer: Samtec; Manufacturer Part Number: ESW-108-23-L-D
J10 = ESW-117-23-L-D: Connector Elevated Socket 34 POS 2.54mm, 13.59mm height; Manufacturer: Samtec; Manufacturer Part Number: ESW-117-23-L-D
R2 R3 R6-R12 R14 R144 R145 R160 = R0603_22R_1%_0.1W_100PPM: as R16 on sheet DAC; Part Number: R0603_22R_1%_0.1W_100PPM; Component Kind: Standard; Component Type: Standard; Pin Count: 2; Value: 22; Status: Preferred; Manufacturer Part Number: R0603_22R_1%_0.1W_100PPM; Case: 0603; Mounted: Yes; Sense: No; Socket: No; SMD: Yes; Manufacturer1 Example: NIC COMPONENT; Manufacturer1 ComponentHeight: 0.55mm; HelpURL: \\cern.ch\dfs\Applications\Altium\Datasheets\R0603_NIC_NRC.pdf; Author: CERN DEM JLC; CreateDate: 03.12.2007; LatestRevisionDate: 13.03.2008
R4 R159 = R0603_100R_1%_0.1W_100PPM: as R25 on sheet DAC; Part Number: R0603_100R_1%_0.1W_100PPM; Component Kind: Standard; Component Type: Standard; Pin Count: 2; Value: 100; Status: Preferred; Manufacturer Part Number: R0603_100R_1%_0.1W_100PPM; Case: 0603; Mounted: Yes; Sense: No; Socket: No; SMD: Yes; Manufacturer1 Example: NIC COMPONENT; Manufacturer1 ComponentHeight: 0.55mm; HelpURL: \\cern.ch\dfs\Applications\Altium\Datasheets\R0603_NIC_NRC.pdf; Author: CERN DEM JLC; CreateDate: 03.12.2007; LatestRevisionDate: 13.03.2008
R5 R65 R120-R123 = R0402_49R9_1%_0.0625W_100PPM: Resistor - 1%; Part Description: General Purpose Thick Film Chip Resistor; Manufacturer: GENERIC; Manufacturer1 Part Number: 232270674999L or RC0402FR-0749R9L; TC: ±100ppm/°C; PressFit: No; Part Number: R0402_49R9_1%_0.0625W_100PPM; Component Kind: Standard; Component Type: Standard; Pin Count: 2; Value: 49R9; Status: Not Recommended; Power: 0.0625W; Manufacturer Part Number: R0402_49R9_1%_0.0625W_100PPM; Case: 0402; Mounted: Yes; Sense: No; Socket: No; SMD: Yes; Manufacturer1 Example: YAGEO PHYCOMP; Manufacturer1 ComponentHeight: 0.4mm; HelpURL: \\cern.ch\dfs\Applications\Altium\Datasheets\R0402_Phycomp_RC0402.pdf; Author: CERN DEM JLC; CreateDate: 24.10.2012; LatestRevisionDate: 24.10.2012
R124 = R0402_100R_1%_0.0625W_100PPM: Resistor - 1%; Part Description: General Purpose Thick Film Chip Resistor; Manufacturer: GENERIC; Manufacturer1 Part Number: 232270671001L; TC: ±100ppm/°C; PressFit: No; Part Number: R0402_100R_1%_0.0625W_100PPM; Component Kind: Standard; Component Type: Standard; Pin Count: 2; Value: 100; Status: Not Recommended; Power: 0.0625W; Manufacturer Part Number: R0402_100R_1%_0.0625W_100PPM; Case: 0402; Mounted: Yes; Sense: No; Socket: No; SMD: Yes; Manufacturer1 Example: YAGEO PHYCOMP; Manufacturer1 ComponentHeight: 0.4mm; HelpURL: \\cern.ch\dfs\Applications\Altium\Datasheets\R0402_Phycomp_RC0402.pdf; Author: CERN DEM JLC; CreateDate: 03.12.2007; LatestRevisionDate: 17.10.2012
R133 R134 = R0603_2K_1%_0.1W_100PPM: Resistor - 1%; Part Description: General Purpose Thick Film Chip Resistor; Manufacturer: GENERIC; Manufacturer1 Part Number: NRC06F2001TRF; Power: 0.1W; TC: ±100ppm/°C; PressFit: No; Part Number: R0603_2K_1%_0.1W_100PPM; Component Kind: Standard; Component Type: Standard; Pin Count: 2; Value: 2k; Status: Preferred; Manufacturer Part Number: R0603_2K_1%_0.1W_100PPM; Case: 0603; Mounted: Yes; Sense: No; Socket: No; SMD: Yes; Manufacturer1 Example: NIC COMPONENT; Manufacturer1 ComponentHeight: 0.55mm; HelpURL: \\cern.ch\dfs\Applications\Altium\Datasheets\R0603_NIC_NRC.pdf; Author: CERN DEM JLC; CreateDate: 03.12.2007; LatestRevisionDate: 13.03.2008
R141 R142 R161 = R0402_10K_1%_0.0625W_100PPM: Resistor - 1%; Part Description: General Purpose Thick Film Chip Resistor; Manufacturer: GENERIC; Manufacturer1 Part Number: 232270671003L; TC: ±100ppm/°C; PressFit: No; Part Number: R0402_10K_1%_0.0625W_100PPM; Component Kind: Standard; Component Type: Standard; Pin Count: 2; Value: 10k; Status: Not Recommended; Power: 0.0625W; Manufacturer Part Number: R0402_10K_1%_0.0625W_100PPM; Case: 0402; Mounted: Yes; Sense: No; Socket: No; SMD: Yes; Manufacturer1 Example: YAGEO PHYCOMP; Manufacturer1 ComponentHeight: 0.4mm; HelpURL: \\cern.ch\dfs\Applications\Altium\Datasheets\R0402_Phycomp_RC0402.pdf; Author: CERN DEM JLC; CreateDate: 03.12.2007; LatestRevisionDate: 17.10.2012
  R141 R142: Tolerance: ±1%
SC1-SC8 = SCREW_M3_CAP_8mm: M3 x 8mm cap head screw; Manufacturer: Accu Limited; Manufacturer Part Number: SSCF-M3-8-12.9-Z
ST1 ST3-ST5 = STANDOFF_HARWIN_R30_1001802: M3.0x18 standoff; Manufacturer: Harwin; Manufacturer Part Number: R30-1001802
TP10-TP14 = SMD_PAD_1.27X1.27MM: as TP15 on sheet DAC; Part Number: SMD_PAD_1.27X1.27MM; Component Type: Standard (No BOM); Pin Count: 1; Family: Test Point; Socket: No; SMD: No; Sense: No; Status: None; ComponentHeight: 0mm; HelpURL: Undefined; Author: CERN DEM JLC; CreateDate: 12.01.2008; LatestRevisionDate: 12.01.2008; PackageDescription: 1.27mm x 1.27mm PCB Copper Area (SMD Test Point)
TP19 = VERO_20-313145: Part Description: Black Bead PCB Terminal Test Pin for 2.4mm PCB Thickness (1.32mm Hole); Manufacturer: VERO TECHNOLOGIES; PressFit: No; Part Number: VERO_20-313145; Component Kind: Standard; Component Type: Standard; Pin Count: 1; Family: Test Point; Mounted: Yes; Socket: No; SMD: No; Sense: No; Status: None; Manufacturer Part Number: 20-313145; ComponentHeight: 5.3mm; HelpURL: \\cern.ch\dfs\Applications\Altium\Datasheets\VERO_20-313145.pdf; Author: CERN DEM JLC; CreateDate: 15.07.2013; LatestRevisionDate: 15.07.2013
W1-W4 = washer_M3_6mm_0.8mm: M3 Washer: / ID: 3.2mm / OD: 6mm / Thickness 0.8mm; Manufacturer: Accu Limited; Manufacturer Part Number: HAFZ-M3-A4

## Sheet AFE_conn.SchDoc: AI ARTIQ Driver
size 420 x 297 mm; Author: G.Kasprowicz; CompanyName: CTI; Organization: CTI; Address1: CTI; Address2: Nowowiejska 15/19 00-665 Warsaw; Address3: gkasprow@gmail.com; DocumentNumber: 7; Revision: 1.0; SheetNumber: 7; SheetTotal: 11; ModifiedBy: -; CheckedDate: -; Title2: AFE con; DivGrp: CTI; ModifiedDate: -; ProjectName: Sensor Box
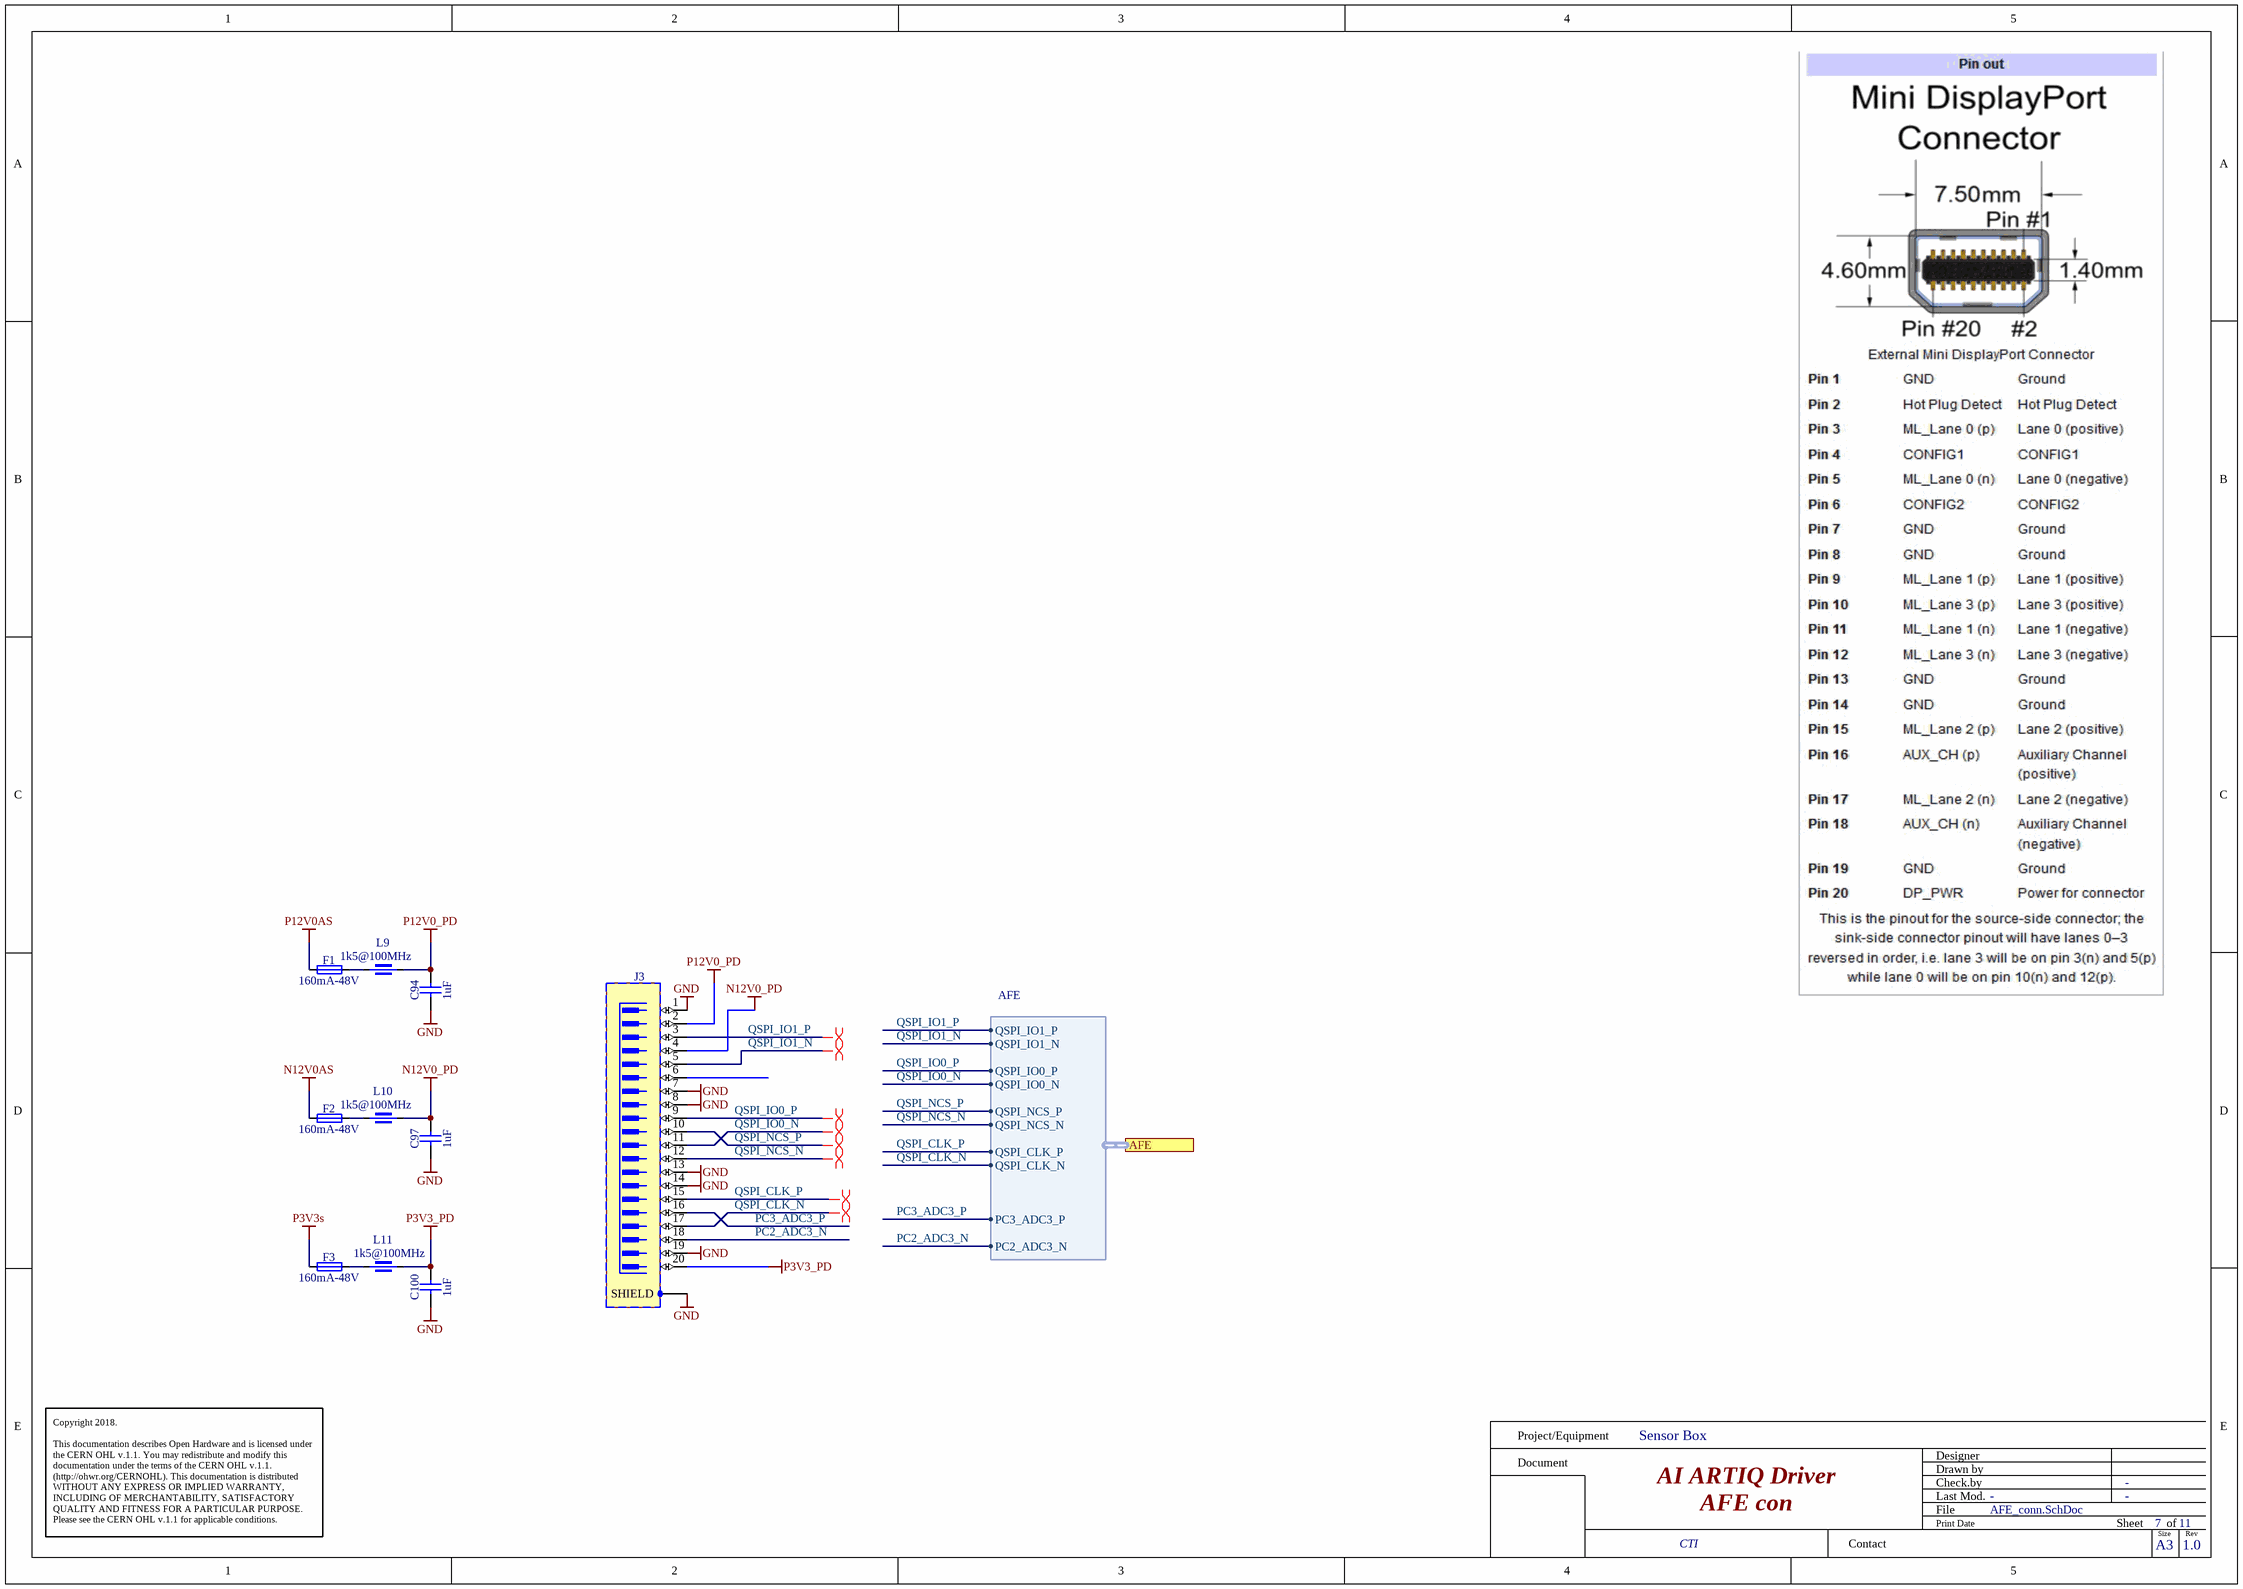
[diagram p4: AFE_conn.SchDoc]

### Parts
C94  1uF  [CAPC2012X135N]
C97  1uF  [CAPC2012X135N]
C100  1uF  [CAPC2012X135N]
F1  160mA-48V  [FUSRC3216X100N]
F2  160mA-48V  [FUSRC3216X100N]
F3  160mA-48V  [FUSRC3216X100N]
J3  Thunderbolt  [JAE_DP3AR020SU32JQ1R400]  (value not drawn)
L9  1k5@100MHz  [INDC2012X110N]
L10  1k5@100MHz  [INDC2012X110N]
L11  1k5@100MHz  [INDC2012X110N]

### Ports
AFE (harness AFE)

### Harnesses
AFE: QSPI_IO1_P, QSPI_IO1_N, QSPI_IO0_P, QSPI_IO0_N, QSPI_NCS_P, QSPI_NCS_N, QSPI_CLK_P, QSPI_CLK_N, PC3_ADC3_P, PC2_ADC3_N

### Nets
GND: C94.1 C97.1 C100.1 J3.1 J3.7 J3.8 J3.13 J3.14 J3.19 J3.SHIELD
N12V0_PD: C97.2 J3.4 L10.2
N12V0AS: F2.1
P3V3_PD: C100.2 J3.20 L11.2
P3V3s: F3.1
P12V0_PD: C94.2 J3.2 L9.2
P12V0AS: F1.1
PC2_ADC3_N: J3.18 ; port AFE.PC2_ADC3_N
PC3_ADC3_P: J3.16 ; port AFE.PC3_ADC3_P
QSPI_CLK_N: J3.17 ; port AFE.QSPI_CLK_N
QSPI_CLK_P: J3.15 ; port AFE.QSPI_CLK_P
QSPI_IO0_N: J3.11 ; port AFE.QSPI_IO0_N
QSPI_IO0_P: J3.9 ; port AFE.QSPI_IO0_P
QSPI_IO1_N: J3.5 ; port AFE.QSPI_IO1_N
QSPI_IO1_P: J3.3 ; port AFE.QSPI_IO1_P
QSPI_NCS_N: J3.12 ; port AFE.QSPI_NCS_N
QSPI_NCS_P: J3.10 ; port AFE.QSPI_NCS_P
NetF1_2: F1.2 L9.1
NetF2_2: F2.2 L10.1
NetF3_2: F3.2 L11.1

Not connected (* = marked no-connect by the designer): J3 6

### Layout directives
differential pair: QSPI_CLK_N, QSPI_CLK_P, QSPI_IO0_N, QSPI_IO0_P, QSPI_IO1_N, QSPI_IO1_P, QSPI_NCS_N, QSPI_NCS_P

### Notes on the sheet
- Project/Equipment
- Document
- Designer
- Drawn by
- Check.by
- Copyright 2018.
  This documentation describes Open Hardware and is licensed under the CERN OHL v.1.1. You may redistribute and modify this documentation under the terms of the CERN OHL v.1.1. (http://ohwr.org/CERNOHL). This documentation is distributed WITHOUT ANY EXPRESS OR IMPLIED WARRANTY, INCLUDING OF MERCHANTABILITY, SATISFACTORY QUALITY AND FITNESS FOR A PARTICULAR PURPOSE. Please see the CERN OHL v.1.1 for applicable conditions.
- Contact
- File
- Last Mod.
- Print Date
- Sheet
- Size
- A3
- of
- Rev

### Library data of the parts
C94 C97 C100 = CC0805_1UF_16V_10%_X7R: Non-polarised capacitor; Part Description: SMD Multilayer Chip Ceramic Capacitor; Manufacturer: GENERIC; Manufacturer1 Part Number: C2012X7R1C105K125AA; Voltage: 16V; TC: X7R; Tolerance: ±10%; Part Number: CC0805_1UF_16V_10%_X7R; Component Kind: Standard; Component Type: Standard; Pin Count: 2; Value: 1uF; Status: Preferred; Manufacturer Part Number: CC0805_1UF_16V_10%_X7R; Case: 0805; Mounted: Yes; Socket: No; SMD: Yes; Sense: No; Manufacturer1 Example: TDK; Manufacturer1 ComponentHeight: 1.45mm; HelpURL: \\cern.ch\dfs\Applications\Altium\Datasheets\CC0805_X7R_TDK_C.pdf; Author: CERN DEM JLC; CreateDate: 03.12.2007; LatestRevisionDate: 22.04.2015
F1-F3 = FUSR1206_LITTELFUSE_NANOSMDC016F: Fuse; Part Description: PolySwitch® Resettable PPTC Overcurrent Protection Device; PressFit: No; Part Number: FUSR1206_LITTELFUSE_NANOSMDC016F; Component Kind: Standard; Component Type: Standard; Pin Count: 2; PackageDescription: Chip Resettable Fuse, 2-Leads, Body 3.2mmx1.6mm, IPC Medium Density; Family: Fuses Resettable; Mounted: Yes; Socket: No; SMD: Yes; Sense: No; Value: 160mA-48V; Manufacturer: LITTELFUSE; Manufacturer Part Number: nanoSMDC016F; ComponentHeight: 1mm; HelpURL: \\cern.ch\dfs\Applications\Altium\Datasheets\FUSR_LITTELFUSE_NanoSMDC.pdf; Author: CERN DEM BC; CreateDate: 25.02.2020; LatestRevisionDate: 25.02.2020
J3 = JAE_DP3AR020SU32JQ1R400: Connector Mini DisplayPort 20 Male + 1 Shield; Part Description: 20 Positions, 0.6mm Pitch, ThunderboltTM Technology Compatible Right Angled Connector; Manufacturer: JAE (JAPAN AVIATION ELECTRONICS INDUSTRY); PressFit: No; Part Number: JAE_DP3AR020SU32JQ1R400; Component Kind: Standard; Component Type: Standard; Pin Count: 21; Family: Thunderbolt; Mounted: Yes; Socket: No; SMD: Yes; Sense: No; Status: None; Manufacturer Part Number: DP3AR020SU32JQ1R400; ComponentHeight: 6.1mm; HelpURL: \\cern.ch\dfs\Applications\Altium\Datasheets\JAE_DP3AR020SU32JQ1R400.pdf; ComponentLink1URL: \\cern.ch\dfs\Applications\Altium\Datasheets\JAE_DP3_Catalog.pdf; ComponentLink1Description: DP3 Series Catalog; Author: CERN DEM JLC; CreateDate: 25.02.2015; LatestRevisionDate: 25.02.2015
L9-L11 = IND0805_WURTH_742792097: Part Description: SMD EMI Suppression Chip Ferrite Bead (WE-CBF Series); Manufacturer: WURTH ELEKTRONIK; Power: 1A; Resistance: 0.3R; Tolerance: ±25%; Part Number: IND0805_WURTH_742792097; Component Kind: Standard; Component Type: Standard; Pin Count: 2; Value: 1k5@100MHz; Manufacturer Part Number: 742792097; Case: 0805; Mounted: Yes; Socket: No; SMD: Yes; Sense: No; ComponentHeight: 1.1mm; HelpURL: \\cern.ch\dfs\Applications\Altium\Datasheets\IND0805_WURTH_742792097.pdf; Author: CERN DEM MR; CreateDate: 29.06.2017; LatestRevisionDate: 25.10.2018

## Sheet I2C.SchDoc: AI ARTIQ Driver
size 420 x 297 mm; Author: G.Kasprowicz; CompanyName: CTI; Organization: CTI; Address1: CTI; Address2: Nowowiejska 15/19 00-665 Warsaw; Address3: gkasprow@gmail.com; DocumentNumber: 8; Revision: 1.0; SheetNumber: 8; SheetTotal: 11; ModifiedBy: -; CheckedDate: -; Title2: I2C expander; DivGrp: CTI; ModifiedDate: -; ProjectName: Sensor Box
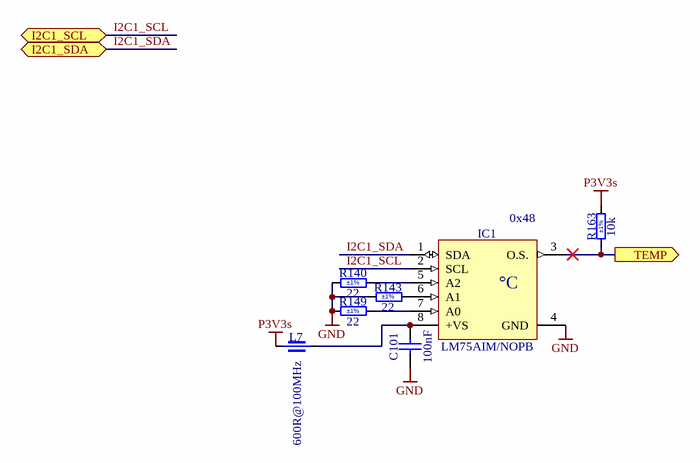
[diagram p5: I2C.SchDoc]

### Parts
C101  100nF  [CAPC1608X87N]
IC1  LM75AIM/NOPB  [SOIC127P600X175-8N]
L7  600R@100MHz  [INDC1608X95N]
R140  22  Tolerance: ±1%  [RESC1608X55N]
R143  22  Tolerance: ±1%  [RESC1608X55N]
R149  22  Tolerance: ±1%  [RESC1608X55N]
R163  10k  Tolerance: ±1%  [RESC1005X40N]

### Ports
I2C1_SCL (bidir), I2C1_SDA (bidir), TEMP (out)

### Nets
GND: C101.1 IC1.4(GND) R140.1 R143.1 R149.1
P3V3s: L7.1 R163.2
I2C1_SCL: IC1.2(SCL) ; port I2C1_SCL
I2C1_SDA: IC1.1(SDA) ; port I2C1_SDA
TEMP: IC1.3(O.S.) R163.1 ; port TEMP
NetC101_2: C101.2 IC1.8(+VS) L7.2
NetIC1_5: IC1.5(A2) R140.2
NetIC1_6: IC1.6(A1) R143.2
NetIC1_7: IC1.7(A0) R149.2

### Notes on the sheet
- (near IC1) 0x48
- Project/Equipment
- Document
- Designer
- Drawn by
- Check.by
- Copyright 2018.
  This documentation describes Open Hardware and is licensed under the CERN OHL v.1.1. You may redistribute and modify this documentation under the terms of the CERN OHL v.1.1. (http://ohwr.org/CERNOHL). This documentation is distributed WITHOUT ANY EXPRESS OR IMPLIED WARRANTY, INCLUDING OF MERCHANTABILITY, SATISFACTORY QUALITY AND FITNESS FOR A PARTICULAR PURPOSE. Please see the CERN OHL v.1.1 for applicable conditions.
- Contact
- File
- Last Mod.
- Print Date
- Sheet
- Size
- A3
- of
- Rev
- (in symbol LM75AIM/NOPB) °C

### Library data of the parts
C101 = CC0603_100NF_50V_10%_X7R: as C11 on sheet DAC; Part Number: CC0603_100NF_50V_10%_X7R; Component Kind: Standard; Component Type: Standard; Pin Count: 2; Value: 100nF; Status: Preferred; Manufacturer Part Number: CC0603_100NF_50V_10%_X7R; Case: 0603; Mounted: Yes; Socket: No; SMD: Yes; Sense: No; Manufacturer1 Example: PHYCOMP; Manufacturer1 ComponentHeight: 0.87mm; HelpURL: \\cern.ch\dfs\Applications\Altium\Datasheets\CC0603_X7R_PHYCOMP.pdf; Author: CERN DEM JLC; CreateDate: 03.12.2007; LatestRevisionDate: 03.12.2007
IC1 = LM75AIM/NOPB: Digital Temperature Sensor and Thermal Watchdog with Two-Wire Interface; Part Description: -25° to +100°C ±2°C Digital Temperature Sensor and Thermal Watchdog with Two-Wire Interface; Manufacturer: TEXAS INSTRUMENTS; PressFit: No; Bonding: No; Part Number: LM75AIM/NOPB; Component Kind: Standard; Component Type: Standard; Device: LM75AIM/NOPB; PackageDescription: SOIC 8, Pitch 1.27mm - Body 4x5mm, IPC Medium Density; Manufacturer Part Number: LM75AIM/NOPB; Pin Count: 8; Case: SOIC8; Mounted: Yes; Socket: No; SMD: Yes; Sense: No; ComponentHeight: 1.75mm; HelpURL: \\cern.ch\dfs\Applications\Altium\Datasheets\LM75AIM-NOPB.pdf; Author: CERN DEM JLC; CreateDate: 15.10.2012; LatestRevisionDate: 15.10.2012
L7 = IND0603_MURATA_BLM18AG601SN1: Part Description: SMD EMIFIL Suppression Chip Ferrite Bead; Manufacturer: MURATA; Power: 500mA; Resistance: 0.38R; Tolerance: ±25%; Part Number: IND0603_MURATA_BLM18AG601SN1; Component Kind: Standard; Component Type: Standard; Pin Count: 2; Value: 600R@100MHz; Status: None; Manufacturer Part Number: BLM18AG601SN1; Case: 0603; Mounted: Yes; Socket: No; SMD: Yes; Sense: No; ComponentHeight: 0.95mm; HelpURL: \\cern.ch\dfs\Applications\Altium\Datasheets\IND0603_MURATA_BLM18A.pdf; Author: CERN DEM MR; CreateDate: 01.04.2016; LatestRevisionDate: 25.10.2018
R140 R143 R149 = R0603_22R_1%_0.1W_100PPM: as R16 on sheet DAC; Part Number: R0603_22R_1%_0.1W_100PPM; Component Kind: Standard; Component Type: Standard; Pin Count: 2; Value: 22; Status: Preferred; Manufacturer Part Number: R0603_22R_1%_0.1W_100PPM; Case: 0603; Mounted: Yes; Sense: No; Socket: No; SMD: Yes; Manufacturer1 Example: NIC COMPONENT; Manufacturer1 ComponentHeight: 0.55mm; HelpURL: \\cern.ch\dfs\Applications\Altium\Datasheets\R0603_NIC_NRC.pdf; Author: CERN DEM JLC; CreateDate: 03.12.2007; LatestRevisionDate: 13.03.2008
R163 = R0402_10K_1%_0.0625W_100PPM: as R141 on sheet connectors; Part Number: R0402_10K_1%_0.0625W_100PPM; Component Kind: Standard; Component Type: Standard; Pin Count: 2; Value: 10k; Status: Not Recommended; Power: 0.0625W; Manufacturer Part Number: R0402_10K_1%_0.0625W_100PPM; Case: 0402; Mounted: Yes; Sense: No; Socket: No; SMD: Yes; Manufacturer1 Example: YAGEO PHYCOMP; Manufacturer1 ComponentHeight: 0.4mm; HelpURL: \\cern.ch\dfs\Applications\Altium\Datasheets\R0402_Phycomp_RC0402.pdf; Author: CERN DEM JLC; CreateDate: 03.12.2007; LatestRevisionDate: 17.10.2012